# Altium schematic sheet LED_Chaser.SchDoc
size A4; SheetNumber: 1; SheetTotal: 1
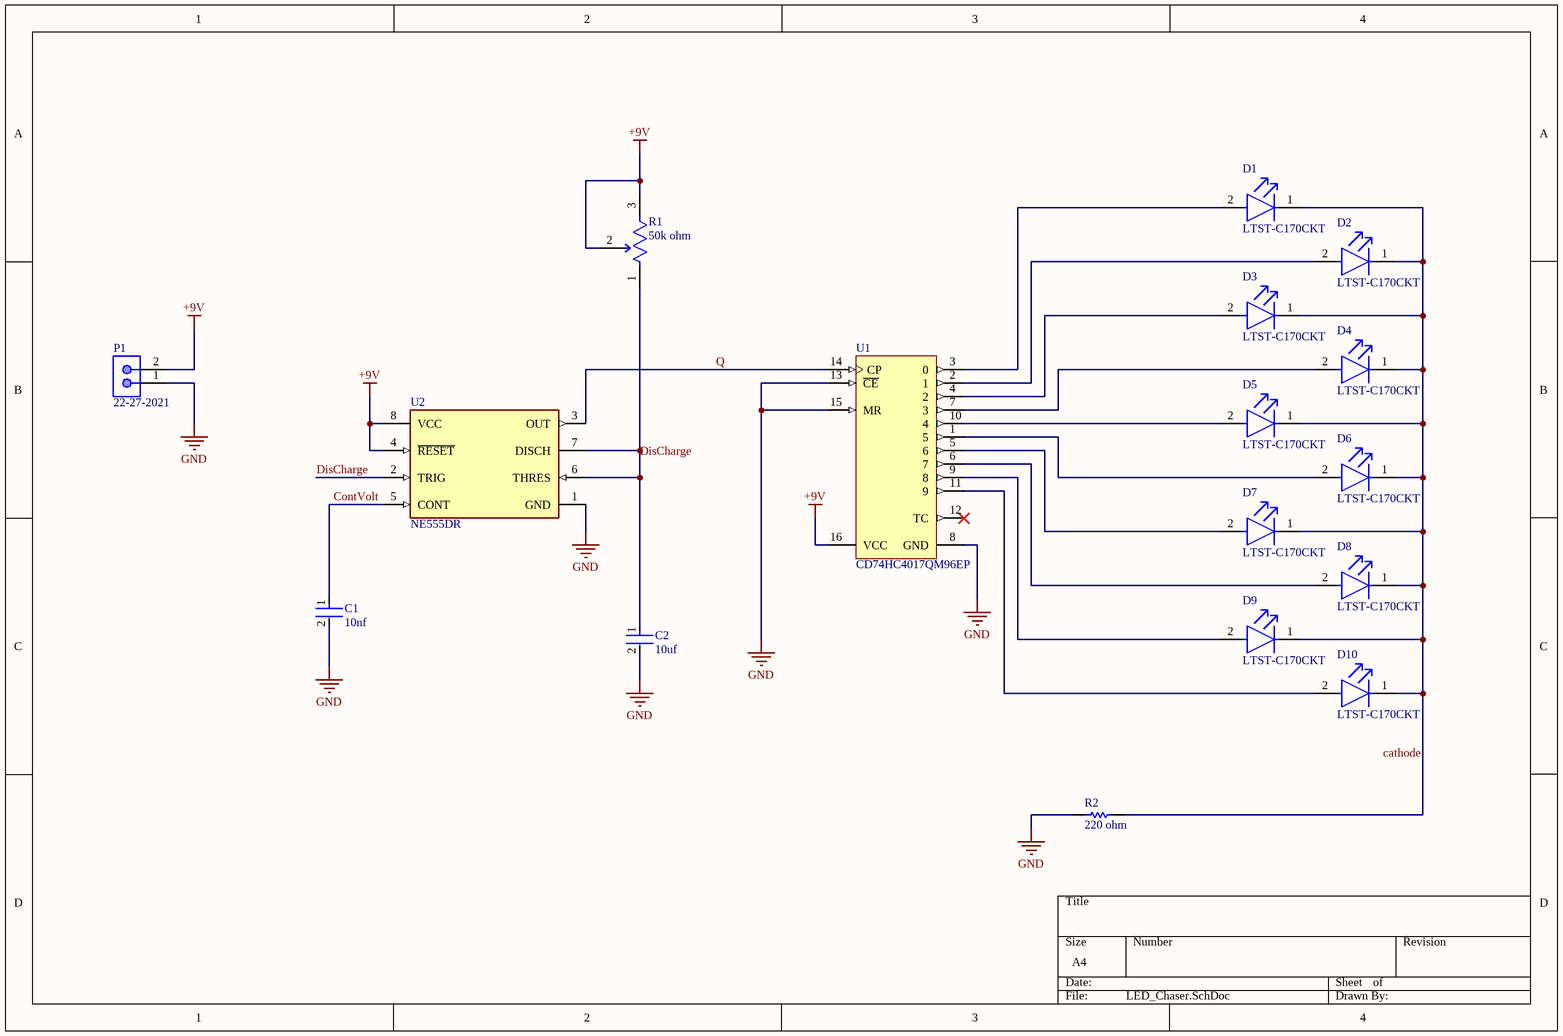
[diagram p0: LED_Chaser.SchDoc]

## Parts
C1  10nf  [FP-CC0805-0_85-MFG]
C2  10uf  [FP-CC0805-0_85-MFG]
D1  LTST-C170CKT  [FP-LTST-C170CKT-MFG]
D2  LTST-C170CKT  [FP-LTST-C170CKT-MFG]
D3  LTST-C170CKT  [FP-LTST-C170CKT-MFG]
D4  LTST-C170CKT  [FP-LTST-C170CKT-MFG]
D5  LTST-C170CKT  [FP-LTST-C170CKT-MFG]
D6  LTST-C170CKT  [FP-LTST-C170CKT-MFG]
D7  LTST-C170CKT  [FP-LTST-C170CKT-MFG]
D8  LTST-C170CKT  [FP-LTST-C170CKT-MFG]
D9  LTST-C170CKT  [FP-LTST-C170CKT-MFG]
D10  LTST-C170CKT  [FP-LTST-C170CKT-MFG]
P1  22-27-2021  [MOLX-22-27-2021_V]
R1  50k ohm  [FP-3361P-MFG]
R2  220 ohm  [RESC2013X60X35ML10T20]
U1  CD74HC4017QM96EP  [D0016A_L]
U2  NE555DR  [FP-D0008A-IPC_A]

## Nets
+9V: P1.2 R1.2(WIPER) R1.3(CW) U1.16(VCC) U2.4(~{RESET}) U2.8(VCC)
GND: C1.2 C2.2 P1.1 R2.1 U1.8(GND) U1.13(~{CE}) U1.15(MR) U2.1(GND)
cathode: D1.1(C) D2.1(C) D3.1(C) D4.1(C) D5.1(C) D6.1(C) D7.1(C) D8.1(C) D9.1(C) D10.1(C) R2.2
ContVolt: C1.1 U2.5(CONT)
DisCharge: C2.1 R1.1(CCW) U2.2(TRIG) U2.6(THRES) U2.7(DISCH)
Q: U1.14(CP) U2.3(OUT)
NetD1_2: D1.2(A) U1.3(0)
NetD2_2: D2.2(A) U1.2(1)
NetD3_2: D3.2(A) U1.4(2)
NetD4_2: D4.2(A) U1.7(3)
NetD5_2: D5.2(A) U1.10(4)
NetD6_2: D6.2(A) U1.1(5)
NetD7_2: D7.2(A) U1.5(6)
NetD8_2: D8.2(A) U1.6(7)
NetD9_2: D9.2(A) U1.9(8)
NetD10_2: D10.2(A) U1.11(9)

Not connected (* = marked no-connect by the designer): U1 12(TC)*

## Library data of the parts
C1 C2 = CMP-2100-03606-3: CAP CER 0.1UF 50V X7R 0805; Manufacturer Part Number: CC0805KRX7R9BB104; Manufacturer: Yageo; Tolerance: 0.1; Material: Ceramic; Device Class L1: Passive Components; ComponentLink2Description: Datasheet; Package: CC0805-0.85; Digikey Description: CAP CER 0.1UF 50V X7R 0805; Device Class L3: Ceramic Capacitors; Temperature: -30°C to +85°C; Temperature Characteristic: X7R; Voltage Rating: 50 V; Height: 0.95mm; RoHS: TRUE; Ipc Land Pattern Name: CAPC200125X85; Device Class L2: Capacitors; Category: Cap; Temperature Range Low: -30°C; Temperature Range High: +85°C; Mouser Description: Multilayer Ceramic Capacitors MLCC - SMD/SMT 100nF 50V X7R 10%; Footprint Url: http://www.yageo.com/exep/pages/download/literatures/UPY-C_GEN_24.pdf; Automotive: No; Octopart: https://octopart.com/cc0805krx7r9bb104-yageo-192993; Lead Free: Yes; ComponentLink2URL: http://www.yageo.com/documents/recent/UPY-GPHC_Y5V_6.3V-to-50V_8.pdf
  C1: Capacitance: 10 nF; Value: 10 nF
  C2: Capacitance: 10 uF; Value: 10 uF
D1-D10 = CMP-1674-00001-6: LED RED CLEAR SMD; Number of Elements: 1; Power Dissipation: 100mW; Lens Color: Colorless; Voltage: 5V; Wavelength: 660nm; Viewing Angle: 130°; Forward Current: 40mA; Luminous Intensity: 10mcd; Forward Voltage: 1.8V; Test Current: 10mA; Dominant Wavelength: 638nm; Lens Style: Diffused; Max Operating Temperature: 85°C; Packaging: Tape and Reel; Case/Package: 0805; Radiation Hardening: No; Illumination Color: Red; Max Power Dissipation: 100mW; Min Operating Temperature: -55°C; Length: 2mm; Reverse Voltage: 5V; Lead Free: Lead Free; Color: Red; Case Code (Imperial): 0805; Package Quantity: 1; Mount: Surface Mount; Case Code (Metric): 2012; Height: 1.1mm; Power Rating: 100mW; Lens Transparency: Clear; Number of LEDs: 1; Number of Pins: 2; Depth: 1.25mm; Width: 1.25mm
P1 = CMP-2000-05537-1: Male Header, Pitch 2.54 mm, 1 x 2 Position, Height 11.7 mm, Tail Length 3.56 mm, 0 to 75 degC, RoHS, Bulk; Manufacturer: Molex; PartNumber: 0022272021; Current rating: 4A; Package Version: Rev. BC, 02/2012; Voltage rating: 250V; No. of Positions: 2; Pitch: 2.54mm; No. of Rows: 1; Orientation: Vertical; Operating temperature: 0°Cto+75°C; Manufacturer URL: http://www.molex.com/; Mounting Technology: ThroughHole; Housing material: Nylon(UL94V-0); Package Description: 2-Leads Header, Body 5.08 x 5.8 mm, Pitch 2.54 mm; Voltage - Max: 250V; Datasheet URL: http://www.molex.com/pdm_docs/sd/022272021_sd.pdf; Package Reference: 22-27-2021; Contact material: Tinplatedbrass; Current - Max: 4A; Datasheet Version: Rev. F, 06/2009
R1 = CMP-07234-000057-1: TRIMMER 50K OHM 0.5W GW TOP ADJ; Power Rating: 500mW; Voltage Rating: 300V; Resistance Tolerance: 10%; Number of Turns: 1; Resistance: 50kR; Temperature Coefficient: 100ppm/°C; Height: 0.205inch; Radiation Hardening: No; RoHS Compliant: Yes; Length: 6.71mm; Depth: 8.53mm; Max Operating Temperature: 125°C; Military Standard: Not; Weight: 0.567g; Technology: CERMET; Voltage Rating (DC): 300V; Width: 0.264inch; Packaging: Tape and Reel; Lead Free: Lead Free; Tolerance: 10%; Reach SVHC Compliant: Yes; Taper: Linear; Min Operating Temperature: -55°C; Color: Natural; Package Quantity: 1; Resistor Type: Cermet; Contact Plating: Tin; Series: 3361; Mount: Surface Mount; Termination: Gull Wing; Max Power Dissipation: 500mW
R2 = CMP-2100-03671-1: Chip Resistor, 1 KOhm, +/- 1%, 125 mW, -55 to 155 degC, 0805 (2012 Metric), RoHS, Tape and Reel; Manufacturer: Yageo; Temperature Coefficient: 100ppm/degreesC; Voltage Rating (DC): 150V; Max Power Dissipation: 125mW; Resistance: 220Ohm; Number of Pins: 2; Number of Terminations: 2; Datasheet URL: http://www.yageo.com/NewPortal/yageodocoutput?fileName=/pdf/R-Chip/PYu-RC_Group_51_RoHS_L_5.pdf; Length: 0.079inch; Package Description: 2-Pin Surface Mounted Device, Body 2 x 1.25 mm; Depth: 1.25mm; Height: 0.024inch; Military Standard: Not; Case/Package: 0805; Package Reference: 0805; RoHSCompliant: true; Lead Free: LeadFree; Packaging: TapeandReel; Package Quantity: 1; Datasheet Version: Rev. 5, 10/2016; Tolerance: 1%; Min Operating Temperature: -55degC; Voltage Rating: 150V; Composition: ThickFilm; Case Code (Imperial): 0805; Power Rating: 125mW; Width: 0.049inch; Case Code (Metric): 2012; Manufacturer URL: http://www.yageo.com/; Max Operating Temperature: 155degC; REACH SVHC: Unknown; Termination: SMD/SMT
U1 = CMP-1623-00110-2: Enhanced Product Decade Counter/Divider With 10 Decoded Outputs, D0016A, LARGE T&R; Manufacturer: Texas Instruments; Generic Part Number: CD74HC4017-EP; Inputs: 1; VCC(Min)(V): 2; Rating: HiRel Enhanced Product; VCC(Max)(V): 6; Bits(#): 10; ICC @ Nom Voltage(Max)(mA): 0.08; F @ Nom Voltage(Max)(Mhz): 28; Technology Family: HC; tpd @ Nom Voltage(Max)(ns): 54; Output Drive (IOL/IOH)(Max)(mA): 5.2/-5.2; Operating Temperature Range(C): -40 to 125; Code_JEDEC: MS-012 variation AC; Type: Decade; Function: Counter; DatasheetVersion: SCLS550; Voltage(Nom)(V): 6; PackageReference: D0016A
U2 = CMP-1685-00007-2: IC OSC SGL TIMER 100KHZ 8-SOIC; Low Level Output Current: 200mA; Quiescent Current: 15mA; Min Supply Voltage: 4.5V; Number of Timers/Counters: 1; Max Supply Voltage: 16V; Operating Supply Current: 10mA; High Level Output Current: -200mA; Packaging: Tape and Reel; Frequency: 100kHz; Weight: 0.002561oz; REACH SVHC: No SVHC; Package Quantity: 2500; Width: 3.91mm; Max Operating Temperature: 70°C; Contact Plating: Gold; Lead Free: Lead Free; Number of Pins: 8; Min Operating Temperature: 0°C; Radiation Hardening: No; Length: 4.9mm; Case/Package: SOIC; Height: 1.58mm; Mount: Surface Mount